# EAGLE design arduino_shield (EAGLE 8.3.2)
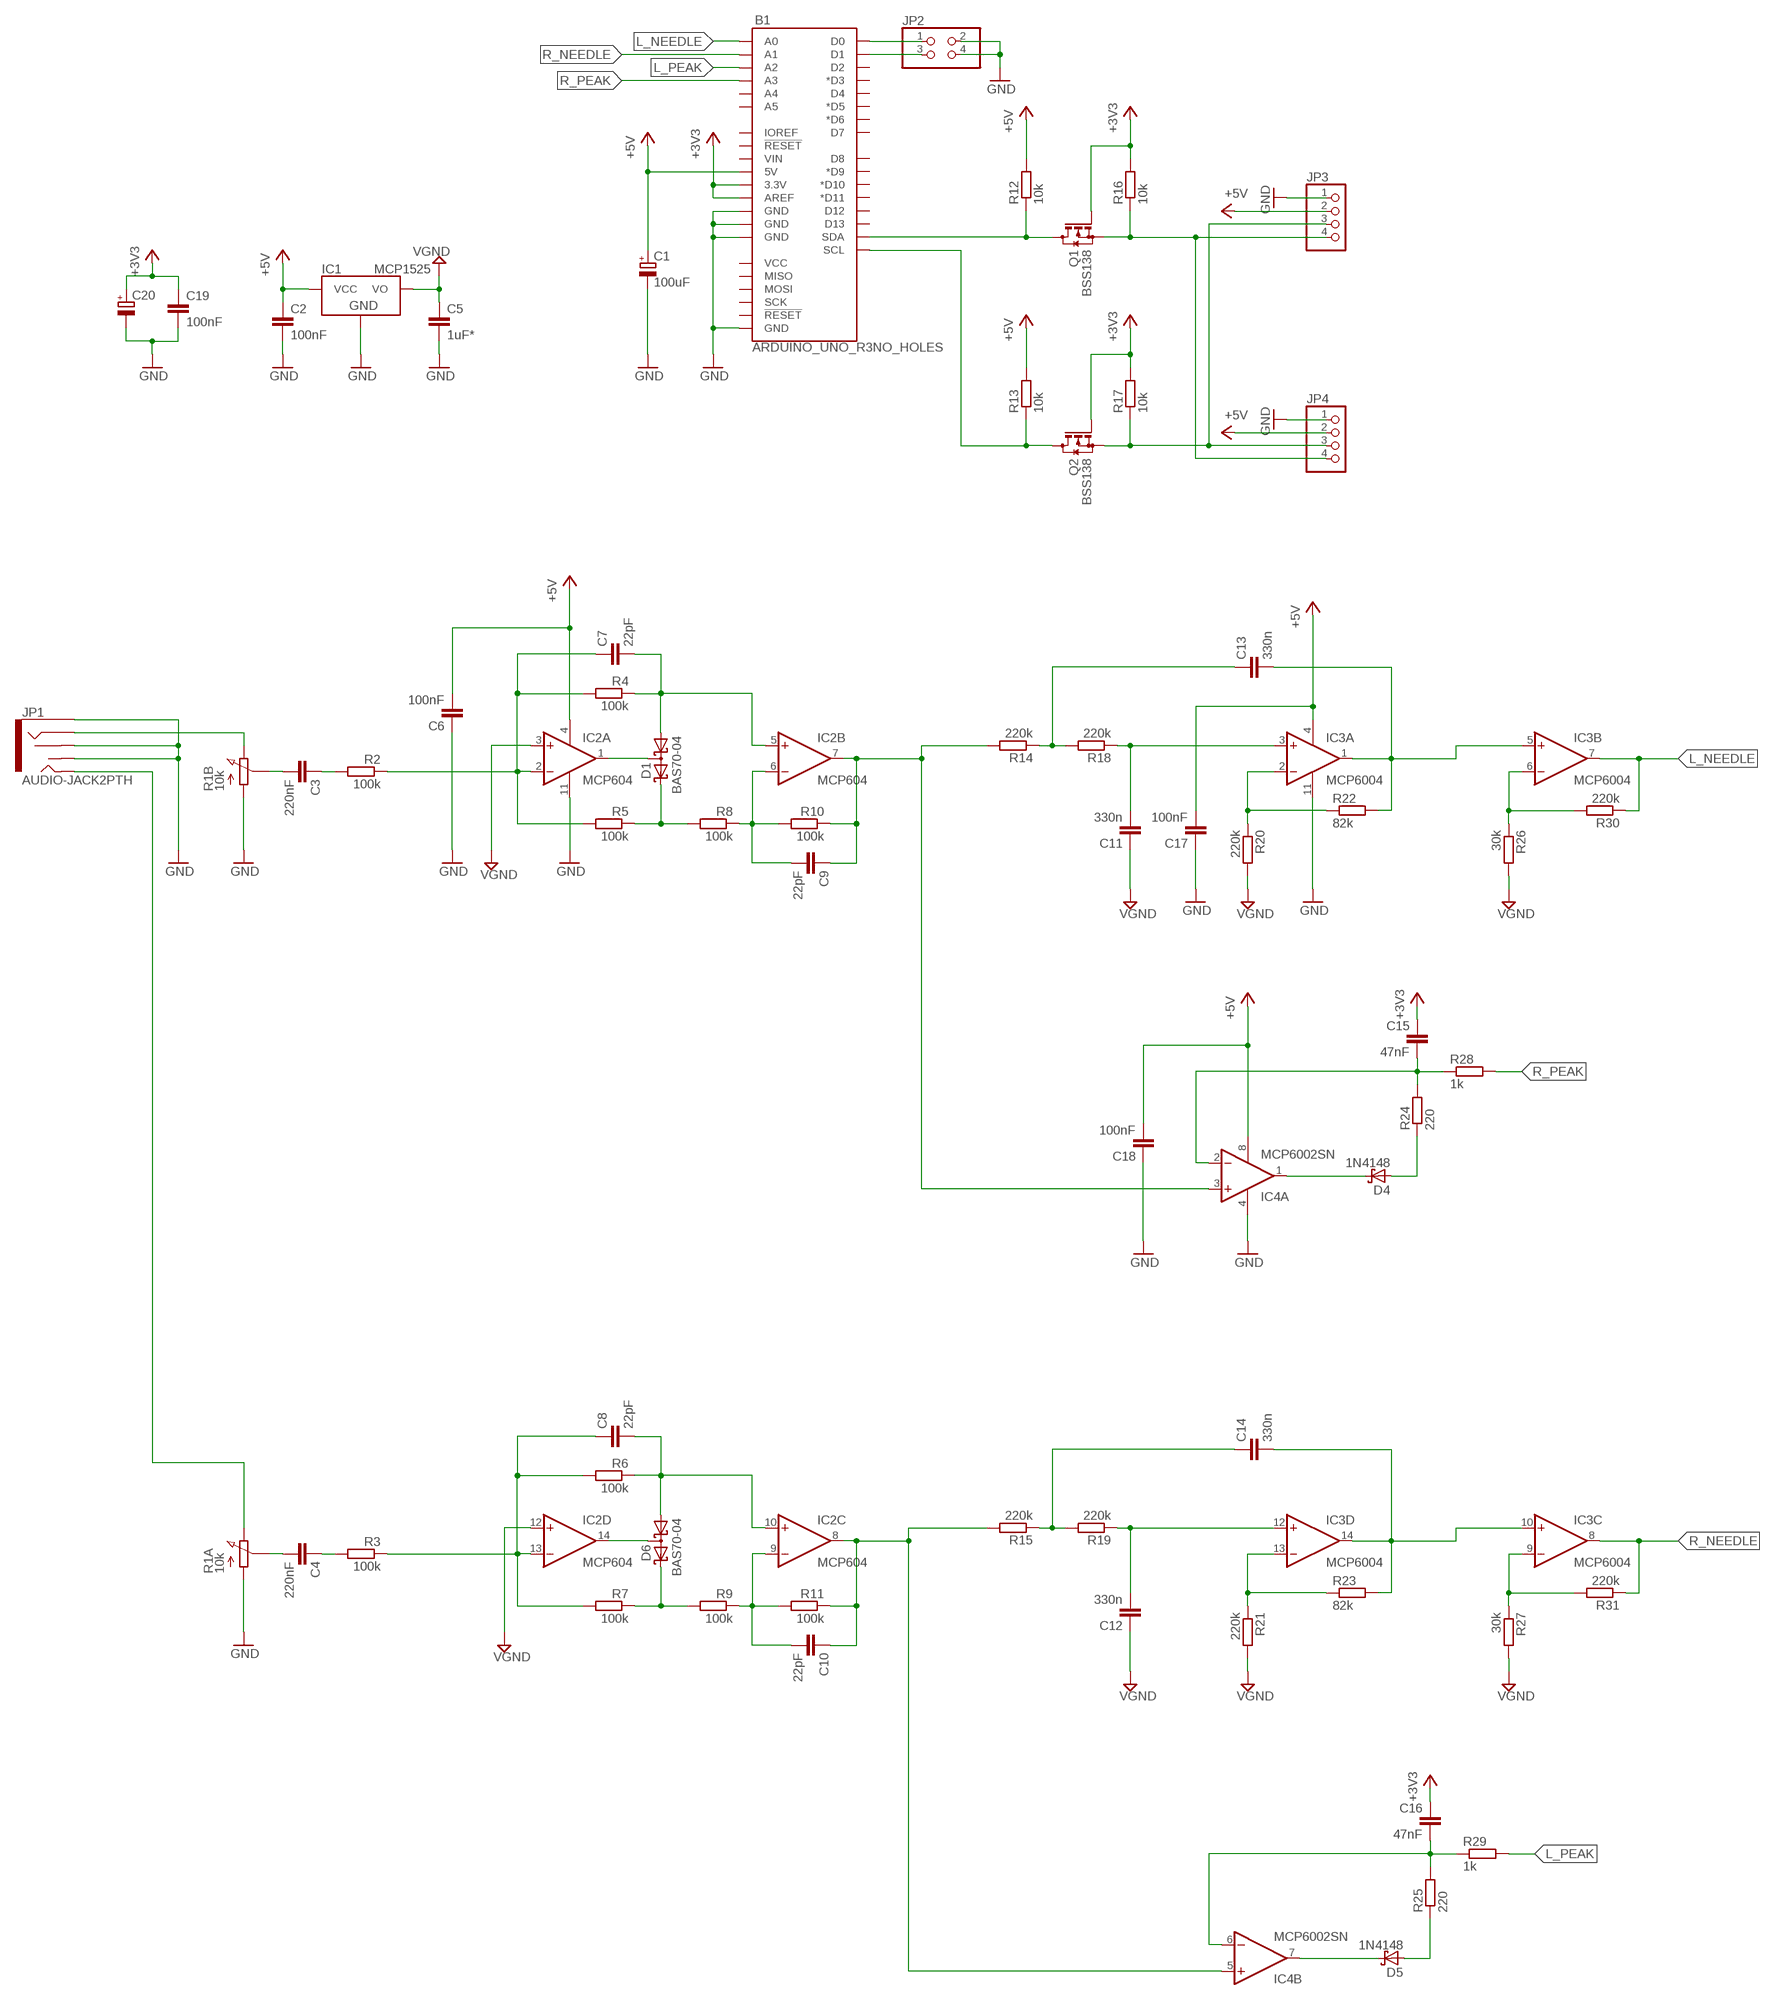
[diagram p0: schematic, sheet 1]

## Parts
B1  ARDUINO_UNO_R3NO_HOLES  [ARDUINO_R3_NO_HOLES]
C1  100uF  CPOL-EUB/3528-21R  [B/3528-21R]
C2  100nF  C-EUC0805  [C0805]
C3  220nF  C-EUC0805  [C0805]
C4  220nF  C-EUC0805  [C0805]
C5  1uF*  C-EUC0805  [C0805]
C6  100nF  C-EUC0805  [C0805]
C7  22pF  C-EUC0805  [C0805]
C8  22pF  C-EUC0805  [C0805]
C9  22pF  C-EUC0805  [C0805]
C10  22pF  C-EUC0805  [C0805]
C11  330n  C-EUC0805  [C0805]
C12  330n  C-EUC0805  [C0805]
C13  330n  C-EUC0805  [C0805]
C14  330n  C-EUC0805  [C0805]
C15  47nF  C-EUC0805  [C0805]
C16  47nF  C-EUC0805  [C0805]
C17  100nF  C-EUC0805  [C0805]
C18  100nF  C-EUC0805  [C0805]
C19  100nF  C-EUC0805  [C0805]
C20  CPOL-EUA/3216-18R  [A/3216-18R]
D1  BAS70-04  [SOT23]
D4  1N4148  BAT60J  [SOD323_ST]
D5  1N4148  BAT60J  [SOD323_ST]
D6  BAS70-04  [SOT23]
IC1  MCP1525  MCP9700SMD  [SOT23-3]
IC2  MCP604  MCP604SL  [SO14]
IC3  MCP6004  MCP604SL  [SO14]
IC4  MCP6002SN  MCP602SN  [SO08]
JP1  AUDIO-JACK2PTH  [AUDIO-JACK]
JP2  PINHD-2X2  [2X02]
JP3  PINHD-1X4  [1X04]
JP4  PINHD-1X4  [1X04]
Q1  BSS138  BSS123  [SOT23]
Q2  BSS138  BSS123  [SOT23]
R1  10k  POT1  [POT1]
R2  100k  R-EU_R0805  [R0805]
R3  100k  R-EU_R0805  [R0805]
R4  100k  R-EU_R0805  [R0805]
R5  100k  R-EU_R0805  [R0805]
R6  100k  R-EU_R0805  [R0805]
R7  100k  R-EU_R0805  [R0805]
R8  100k  R-EU_R0805  [R0805]
R9  100k  R-EU_R0805  [R0805]
R10  100k  R-EU_R0805  [R0805]
R11  100k  R-EU_R0805  [R0805]
R12  10k  R-EU_R0805  [R0805]
R13  10k  R-EU_R0805  [R0805]
R14  220k  R-EU_M0805  [M0805]
R15  220k  R-EU_M0805  [M0805]
R16  10k  R-EU_R0805  [R0805]
R17  10k  R-EU_R0805  [R0805]
R18  220k  R-EU_R0805  [R0805]
R19  220k  R-EU_R0805  [R0805]
R20  220k  R-EU_R0805  [R0805]
R21  220k  R-EU_R0805  [R0805]
R22  82k  R-EU_R0805  [R0805]
R23  82k  R-EU_R0805  [R0805]
R24  220  R-EU_R0805  [R0805]
R25  220  R-EU_R0805  [R0805]
R26  30k  R-EU_M0805  [M0805]
R27  30k  R-EU_M0805  [M0805]
R28  1k  R-EU_R0805  [R0805]
R29  1k  R-EU_R0805  [R0805]
R30  220k  R-EU_M0805  [M0805]
R31  220k  R-EU_M0805  [M0805]

## Nets
+3V3: B1.3.3V B1.AREF C15.1 C16.1 C19.1 C20.+ Q1.1(G) Q2.1(G) R16.2 R17.2
+5V: B1.5V C1.+ C2.1 C6.2 C17.2 C18.2 IC1.1(VCC) IC2.4(P:V+) IC3.4(P:V+) IC4.8(P:V+) JP3.2 JP4.2 R12.2 R13.2
GND: B1.GND@1(GND) B1.GND@2(GND) B1.GND@3(GND) B1.GND@4(GND) C1.- C2.2 C5.2 C6.1 C17.1 C18.1 C19.2 C20.- IC1.3(GND) IC2.11(P:V-) IC3.11(P:V-) IC4.4(P:V-) JP1.RSH JP1.SLEEVE JP1.TSH JP2.2 JP2.4 JP3.1 JP4.1 R1.1-1(A:A-1) R1.2-1(B:A-1)
GND1: C5.1 C11.1 C12.1 IC1.2(VO) IC2.3(A:+IN) IC2.12(D:+IN) R20.2 R21.2 R26.2 R27.2 ; supply symbol labelled VGND
L_NEEDLE: B1.A0 IC3.7(B:OUT) R30.1
L_PEAK: B1.A2 R29.2
N$1: IC3.6(B:-IN) R26.1 R30.2
N$2: B1.D0 JP2.1
N$3: B1.SDA Q1.3(D) R12.1
N$4: D5.A R25.1
N$6: B1.SCL Q2.3(D) R13.1
N$7: B1.D1 JP2.3
N$8: D5.C IC4.7(B:OUT)
N$9: C13.1 R14.1 R18.2
N$10: C13.2 IC3.1(A:OUT) IC3.5(B:+IN) R22.2
N$11: C16.2 IC4.6(B:-IN) R25.2 R29.1
N$13: IC3.9(C:-IN) R27.1 R31.2
N$14: C11.2 IC3.3(A:+IN) R18.1
N$15: IC3.2(A:-IN) R20.1 R22.1
N$16: D1.2(C2) R5.1 R8.2
N$17: C12.2 IC3.12(D:+IN) R19.1
N$18: C3.2 R1.2-2(B:S-2)
N$19: C7.1 IC2.2(A:-IN) R2.1 R4.2 R5.2
N$20: D4.C IC4.1(A:OUT)
N$23: IC3.13(D:-IN) R21.1 R23.1
N$24: C14.1 R15.1 R19.2
N$25: C7.2 D1.1(A1) IC2.5(B:+IN) R4.1
N$26: D1.3(C1A2) IC2.1(A:OUT)
N$27: C9.2 IC2.6(B:-IN) R8.1 R10.2
N$28: C14.2 IC3.10(C:+IN) IC3.14(D:OUT) R23.2
N$31: D6.2(C2) R7.1 R9.2
N$33: C8.1 IC2.13(D:-IN) R3.1 R6.2 R7.2
N$34: C8.2 D6.1(A1) IC2.10(C:+IN) R6.1
N$35: D6.3(C1A2) IC2.14(D:OUT)
N$36: C10.2 IC2.9(C:-IN) R9.1 R11.2
N$37: C10.1 IC2.8(C:OUT) IC4.5(B:+IN) R11.1 R15.2
N$38: C4.2 R1.1-2(A:S-2)
N$39: C4.1 R3.2
N$40: C3.1 R2.2
N$41: JP1.RING R1.2-3(B:E-3)
N$42: JP1.TIP R1.1-3(A:E-3)
N$44: C15.2 IC4.2(A:-IN) R24.2 R28.1
N$45: D4.A R24.1
N$48: C9.1 IC2.7(B:OUT) IC4.3(A:+IN) R10.1 R14.2
R_NEEDLE: B1.A1 IC3.8(C:OUT) R31.1
R_PEAK: B1.A3 R28.2
SCL: JP3.3 JP4.3 Q2.2(S) R17.1
SDA: JP3.4 JP4.4 Q1.2(S) R16.1
Unconnected: B1.A4 B1.A5 B1.D2 B1.D3(*D3) B1.D4 B1.D5(*D5) B1.D6(*D6) B1.D7 B1.D8 B1.D9(*D9) B1.D10(*D10) B1.D11(*D11) B1.D12 B1.D13 B1.IOREF B1.MISO B1.MOSI B1.RESET@1(!RESET!) B1.RESET@2(!RESET!) B1.SCK B1.VCC B1.VIN

## Library data of the parts
B1 = SparkFun-Boards:ARDUINO_UNO_R3: Arduino R3 Footprint with SPI header Arduino Uno R3 Compatible Footprint. Matches PCB size of the original board. SparkFun Products: SAMD21 Dev Breakout <https://www.sparkfun.com/products/13672> RedBoard <https://www.sparkfun.com/products/12757> R3 Stackable Headers <https://www.sparkfun.com/products/11417>
C1 C20 = rcl:CPOL-EU: POLARIZED CAPACITOR, European symbol
C2-C19 = rcl:C-EU: CAPACITOR, European symbol
D1 D6 = diode:BAS70-04: Silicon Schottky Diodes General-purpose diode for high-speed switching
D4 D5 = diode:BAT60J: Schottky barrier diode Source: www.st.com, BAT60J.pdf
IC1 = SparkFun:MCP9700
IC2 IC3 = linear:MCP604: Quad Op Amp 2.7V to 6.0V Single Supply CMOS Source: http://ww1.microchip.com/downloads/en/DeviceDoc/21314g.pdf
IC4 = linear:MCP602: Single Op Amp 2.7V to 6.0V Single Supply CMOS Source: http://ww1.microchip.com/downloads/en/DeviceDoc/21314g.pdf
JP1 = SparkFun:AUDIO-JACK2
JP2 = pinhead:PINHD-2X2: PIN HEADER
JP3 JP4 = pinhead:PINHD-1X4: PIN HEADER
Q1 Q2 = transistor-small-signal:BSS123: N-CHANNEL MOS FET
R1 = vu_meter:POT1
R2-R31 = rcl:R-EU_: RESISTOR, European symbol

## Module BALLISTICS
Ports: INPUT(io) OUTPUT(io)

### Library data of the parts

## Board
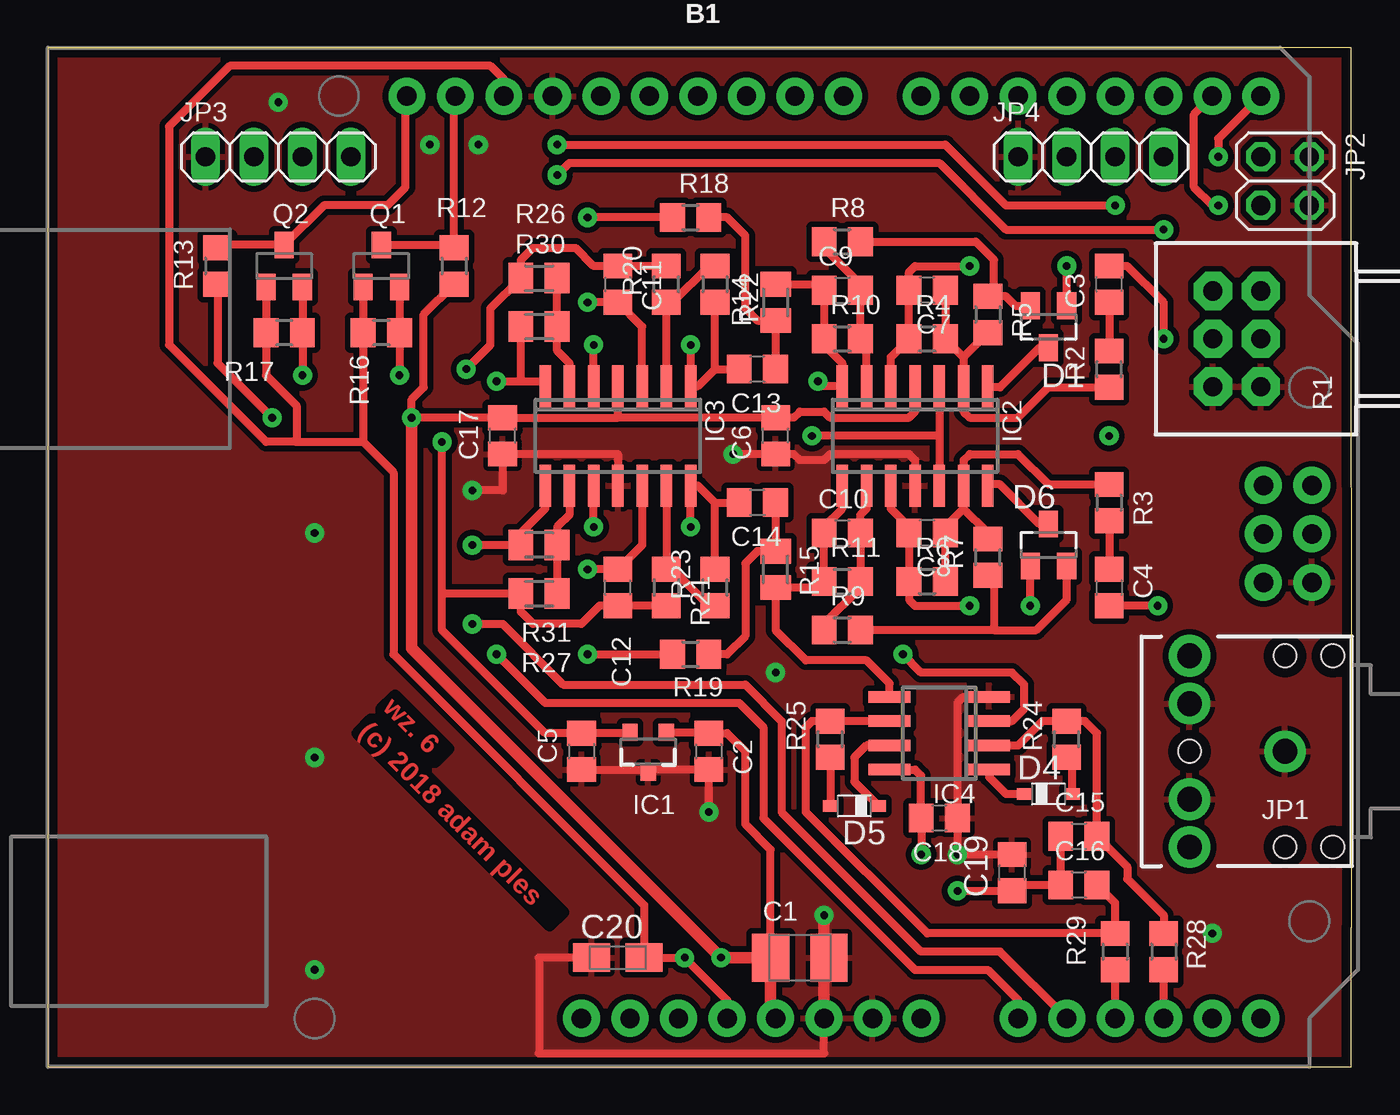
[diagram p1: board, top side]
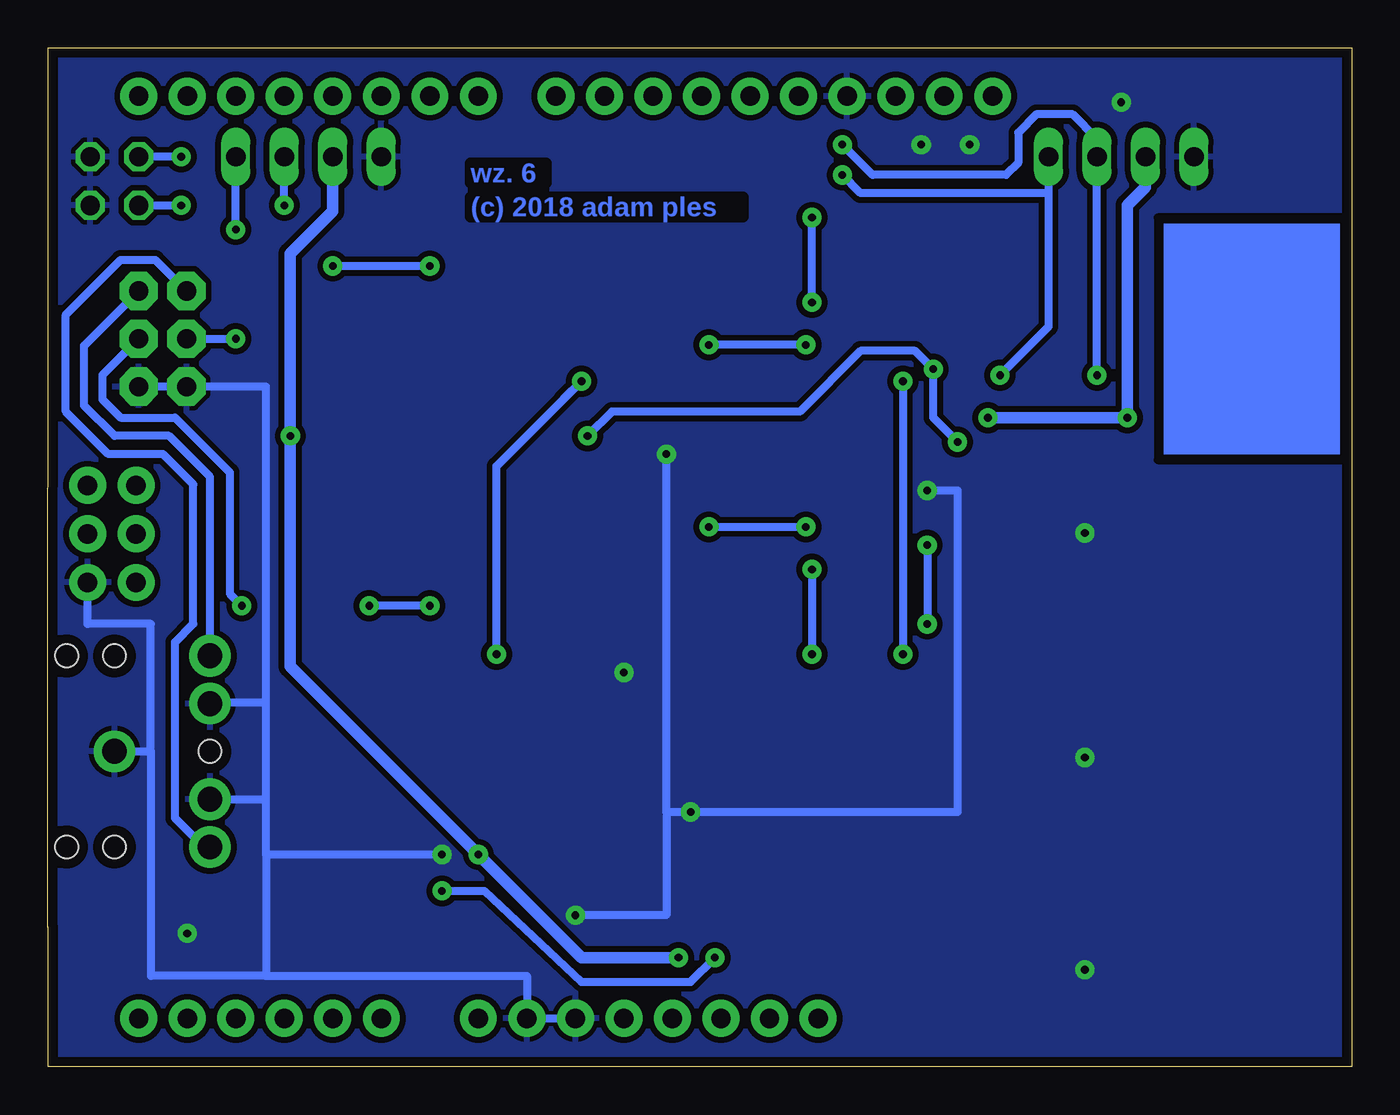
[diagram p2: board, bottom side, seen from below]

Size 68.26 x 53.33 mm. Coordinates in mm from the lower left corner, seen from the top.
Outline: 0,0 68.25,0 68.25,7.3 68.26,7.3 68.25,53.33 0,53.33 0,0
Copper layers (1*16): Top 0.035mm / dielectric 1.5mm / Bottom 0.035mm
Design rules "default *": minimum track width 6mil, minimum drill 0.35mm, track to track 12mil, track to pad 12mil, pad to pad 12mil, via to via 12mil, smd to smd 10mil, copper to edge 20mil, drill to drill 6mil, minimum pad ring 10mil, minimum via ring 8mil, stop-mask expansion 4mil, vias tented up to drill 0mil, thermal gap 10mil
bRestrict: 4 lines

### Footprints (pad centres in the part's own frame; a part is rotated, then mirrored left to right if it is on the bottom)
ARDUINO_R3_NO_HOLES = drill 1.016 pad 1.93: 3.3V 1.27,-24.13; 5V 3.81,-24.13; A0 16.51,-24.13; A1 19.05,-24.13; A2 21.59,-24.13; A3 24.13,-24.13; A4 26.67,-24.13; A5 29.21,-24.13; AREF -10.414,24.13; D0 29.21,24.13; D1 26.67,24.13; D2 24.13,24.13; D3 21.59,24.13; D4 19.05,24.13; D5 16.51,24.13; D6 13.97,24.13; D7 11.43,24.13; D8 7.366,24.13; D9 4.826,24.13; D10 2.286,24.13; D11 -0.254,24.13; D12 -2.794,24.13; D13 -5.334,24.13; GND@1 6.35,-24.13; GND@2 8.89,-24.13; GND@3 -7.874,24.13; GND@4 31.89,-1.32; IOREF -3.81,-24.13; MISO 29.35,3.76; MOSI 31.89,1.22; NC -6.35,-24.13; RESET@1 -1.27,-24.13; RESET@2 29.35,-1.32; SCK 29.35,1.22; SCL -15.494,24.13; SDA -12.954,24.13; VCC 31.89,3.76; VIN 11.43,-24.13
B/3528-21R = smd 1.95 x 2.5: + 1.525,0; - -1.525,0
C0805 = smd 1.3 x 1.5: 1 -0.95,0; 2 0.95,0
A/3216-18R = smd 1.95 x 1.5: + 1.375,0; - -1.375,0
SOT23 = smd 1 x 1.4: 1 -0.95,-1.1; 2 0.95,-1.1; 3 0,1.1
SOD323_ST = smd 0.8 x 0.6: A 1.25,0; C -1.25,0
SOT23-3 = smd 0.8 x 0.9: 1 -0.95,-1; 2 0.95,-1; 3 0,1.1
SO14 = smd 0.6 x 2.2: 1 -3.81,-2.6; 2 -2.54,-2.6; 3 -1.27,-2.6; 4 0,-2.6; 5 1.27,-2.6; 6 2.54,-2.6; 7 3.81,-2.6; 8 3.81,2.6; 9 2.54,2.6; 10 1.27,2.6; 11 0,2.6; 12 -1.27,2.6; 13 -2.54,2.6; 14 -3.81,2.6
SO08 = smd 0.6 x 2.2: 1 -1.905,-2.6; 2 -0.635,-2.6; 3 0.635,-2.6; 4 1.905,-2.6; 5 1.905,2.6; 6 0.635,2.6; 7 -0.635,2.6; 8 -1.905,2.6
AUDIO-JACK = drill 1.3 pad 2.184: RING 5,5; RSH 5,2.5; SLEEVE 0,0; TIP 5,-5; TSH 5,-2.5 | hole 1.2: 0,5; -2.5,5; -2.5,-5; 0,-5; 5,0
2X02 = drill 1.016 octagon: 1 -1.27,-1.27; 2 -1.27,1.27; 3 1.27,-1.27; 4 1.27,1.27
1X04 = drill 1.016 long: 1 -3.81,0; 2 -1.27,0; 3 1.27,0; 4 3.81,0
POT1 = drill 1 pad 2 octagon: 1-1 -2.5,0; 1-2 0,0; 1-3 2.5,0; 2-1 -2.5,2.5; 2-2 0,2.5; 2-3 2.5,2.5
R0805 = smd 1.3 x 1.5: 1 -0.95,0; 2 0.95,0
M0805 = smd 1.3 x 1.6: 1 -0.95,0; 2 0.95,0

### Placement (x,y rotation side)
B1  34.29,26.67 0 top
C1  39.37,5.71 180 top
C2  34.61,16.51 270 top
C3  55.56,40.96 90 top
C4  55.56,25.08 270 top
C5  27.94,16.51 270 top
C6  38.1,33.02 90 top
C7  46.04,40.64 180 top
C8  46.04,27.94 180 top
C9  41.59,40.64 0 top
C10  41.59,27.94 0 top
C11  29.84,40.96 270 top
C12  29.84,25.08 90 top
C13  37.15,36.51 180 top
C14  37.15,29.53 180 top
C15  53.98,12.06 0 top
C16  53.98,9.53 0 top
C17  23.81,33.02 90 top
C18  46.67,13.02 180 top
C19  50.48,10.16 90 top
C20  29.84,5.71 0 top
D1  52.39,38.73 180 top
D4  52.39,14.29 0 top
D5  42.23,13.65 180 top
D6  52.39,27.3 0 top
IC1  31.43,16.51 180 top
IC2  45.4,33.02 180 top
IC3  29.84,33.02 180 top
IC4  46.67,17.46 90 top
JP1  64.77,16.51 180 top
JP2  64.77,46.35 270 top
JP3  12.06,47.62 0 top
JP4  54.61,47.62 0 top
Q1  17.46,41.91 0 top
Q2  12.38,41.91 0 top
R1  63.5,38.1 90 top
R2  55.56,36.51 90 top
R3  55.56,29.53 270 top
R4  46.04,38.1 0 top
R5  49.21,39.37 270 top
R6  46.04,25.4 0 top
R7  49.21,26.67 90 top
R8  41.59,43.18 0 top
R9  41.59,22.86 0 top
R10  41.59,38.1 0 top
R11  41.59,25.4 0 top
R12  21.27,41.91 270 top
R13  8.89,41.91 270 top
R14  38.1,40.01 90 top
R15  38.1,26.04 270 top
R16  17.46,38.42 180 top
R17  12.38,38.42 180 top
R18  33.66,44.45 0 top
R19  33.66,21.59 0 top
R20  32.38,40.96 90 top
R21  32.38,25.08 270 top
R22  34.92,40.96 270 top
R23  34.92,25.08 90 top
R24  53.34,17.14 90 top
R25  40.96,17.14 90 top
R26  25.72,41.27 180 top
R27  25.72,24.77 180 top
R28  58.42,6.03 270 top
R29  55.88,6.03 270 top
R30  25.72,38.73 0 top
R31  25.72,27.3 0 top

### Tracks (layer width: path | path; a pad name or v marks a point on that pad's centre or on a via)
+3V3  (via drill 0.4 pad 1)
  Top 0.406: Q2.1 R17.2 11.43,36.19 13.02,34.61 13.02,32.7 | Q1.1 R16.2 16.51,32.7 | B1.AREF 23.88,51.69 23.18,52.39 9.53,52.39 6.35,49.21 6.35,37.78 11.43,32.7 13.02,32.7 | 13.02,32.7 16.51,32.7 | 16.51,32.7 18.1,31.11 18.1,21.59 31.22,8.47 C20.+ v33.34,5.71 35.56,3.49 B1.3.3V | C15.1 C16.1 50.8,9.53 C19.1 48.26,9.21 v47.62,9.21
  Bottom 0.406: v47.62,9.21 45.4,9.21 40.32,4.45 34.61,4.45 v33.34,5.71
+5V  (via drill 0.4 pad 1)
  Top 0.406: IC2.4 45.4,34.29 45.08,33.97 40.96,33.97 40.64,34.29 39.37,34.29 39.05,33.97 C6.2 29.85,33.97 | 29.85,33.97 C17.2 v19.05,33.97 19.05,34.92 19.68,35.56 19.68,39.37 R12.2 | 29.85,33.97 29.84,34.29 IC3.4 | IC1.1 34.56,17.51 C2.1 35.56,17.46 36.51,16.51 36.51,12.7 37.84,11.37 C1.+ 38.1,5.65 | R13.2 8.89,36.83 v11.75,33.97 | IC4.8 45.4,15.56 45.72,15.24 C18.2 | C18.2 v45.72,11.11 | C18.2
  Top 0.61: v19.05,33.97 19.05,21.91 v35.24,5.71 C1.+ 37.84,2.79 B1.5V
  Bottom 0.61: JP3.2 10.79,46.04 11.75,45.09 v11.75,33.97 v19.05,33.97 | JP4.2 53.34,44.77 55.56,42.55 v55.56,33.02 55.56,20.95 v45.72,11.11 40.32,5.71 v35.24,5.71
GND  (via drill 0.4 pad 1)
  Top 0.406: IC2.11 45.4,31.75 45.08,32.07 40.96,32.07 40.64,31.75 39.37,31.75 39.05,32.07 C6.1 v35.88,32.07 | IC3.11 29.84,31.75 29.85,32.07 C17.1 23.81,30.16 v22.23,30.16 | C5.2 31.28,15.56 IC1.3 31.58,15.56 C2.2 v34.61,13.34 | IC4.4 47.94,19.37 47.62,19.05 C18.1 v47.62,11.12 v47.62,11.11 C19.2 | C20.- 25.72,5.71 25.72,0.71 40.64,0.71 B1.GND@1
  Top 0.61: B1.GND@1 40.64,5.71 | v40.64,7.94 40.64,5.71 | 40.64,5.71 C1.-
  Bottom 0.406: v40.64,7.94 35.88,7.94 35.88,13.34 | v22.23,30.16 20.64,30.16 20.64,13.34 v34.61,13.34 35.88,13.34 | 63.54,35.56 R1.1-1 R1.2-1 56.83,35.6 56.83,19.05 | 56.83,11.11 56.83,14.01 | 56.83,11.11 56.83,4.76 | 56.83,14.01 56.83,19.05 | 56.83,19.05 59.77,19.05 JP1.TSH | JP1.RSH 56.83,14.01 | 35.88,13.34 v35.88,32.07 | B1.GND@1 B1.GND@2 43.18,4.76 56.83,4.76 | 56.83,4.76 62.87,4.76 62.87,16.51 | 62.87,16.51 62.87,23.18 66.18,23.18 B1.GND@4 | JP1.SLEEVE 62.87,16.51 | v47.62,11.11 56.83,11.11
  other vias: 20,48.26 22.54,48.26 38.1,20.64 12.06,50.48 13.97,5.08 13.97,16.19 13.97,27.94 60.96,6.99
  pour Bottom: 0,53.34 68.26,53.34 68.26,0 0,0
  pour Top: 0,53.34 0,0 68.26,0 68.26,53.34
GND1  (via drill 0.4 pad 1)
  Top 0.406: IC2.3 46.67,33.02 | 46.67,33.02 IC2.12 | IC1.2 30.43,17.46 C5.1 26.04,17.46 20.64,22.86 20.64,24.77 | 46.67,33.02 v40.01,33.02 | R20.2 C11.1 | C11.1 | R21.2 C12.1 | C12.1 | C12.1 28.89,24.13 27.94,23.18 25.4,23.18 24.77,23.81 R27.2 20.64,24.77 | R26.2 | 20.64,24.77 v20.64,32.7 | v21.91,36.51 23.18,37.78 23.18,39.69 R26.2 | C11.1 28.58,41.91 27.62,42.86 25.4,42.86 24.77,42.23 R26.2
  Bottom 0.406: v20.64,32.7 21.91,33.97 v21.91,36.51 22.86,37.47 25.72,37.47 28.89,34.29 38.73,34.29 v40.01,33.02
L_NEEDLE  (via drill 0.4 pad 1)
  Top 0.406: v23.5,21.59 26.04,19.05 36.2,19.05 37.47,17.78 37.47,13.02 45.4,5.08 49.21,5.08 50.8,3.49 B1.A0 | R30.1 24.77,35.88 | 24.77,35.88 26.04,35.88 IC3.7 | v23.5,35.88 24.77,35.88
  Bottom 0.406: v23.5,35.88 v23.5,21.59
L_PEAK
  Top 0.406: B1.A2 R29.2
N$1
  Top 0.406: IC3.6 27.3,36.83 26.67,37.47 R30.2 R26.1
N$2  (via drill 0.4 pad 1)
  Top 0.406: B1.D0 61.28,48.58 v61.28,47.62
  Bottom 0.406: v61.28,47.62 JP2.1
N$3
  Top 0.406: Q1.3 20.49,43.01 R12.1 21.27,50.74 B1.SDA
N$4
  Top 0.406: R25.1 40.98,16.18 D5.A
N$6
  Top 0.406: R13.1 9.04,43.01 Q2.3 14.46,45.09 17.78,45.09 18.73,46.04 18.73,50.74 B1.SCL
N$7  (via drill 0.4 pad 1)
  Top 0.406: v61.28,45.09 60.96,45.09 60.01,46.04 60.01,49.85 B1.D1
  Bottom 0.406: JP2.3 v61.28,45.09
N$8
  Top 0.406: IC4.7 42.86,16.83 42.23,16.19 42.23,14.92 43.48,13.67 D5.C
N$9
  Top 0.406: R18.2 35.56,44.45 36.51,43.5 36.51,39.69 37.15,39.05 R14.1 C13.1
N$10  (via drill 0.4 pad 1)
  Top 0.406: 34.92,36.51 34.03,35.62 IC3.1 v33.66,37.78 | 34.92,36.51 C13.2 | 34.92,36.51 R22.2 | IC3.5 v28.57,37.78
  Bottom 0.406: v28.57,37.78 v33.66,37.78
N$11
  Top 0.406: C16.2 55.88,8.57 R29.1 | R29.1 | R29.1 46.04,6.99 39.69,13.34 39.69,17.78 40.01,18.1 R25.2 IC4.6
N$13
  Top 0.406: IC3.9 27.3,28.89 26.67,28.26 R31.2 R27.1
N$14  (via drill 0.4 pad 1)
  Top 0.406: IC3.3 31.11,38.74 C11.2 v28.25,40.01 v28.26,40.01 | R18.1 v28.26,44.45
  Bottom 0.406: v28.26,40.01 v28.26,44.45
N$15
  Top 0.406: IC3.2 R20.1 32.7,40.01 34.6,41.91 R22.1
N$16
  Top 0.406: R8.2 48.58,43.18 49.53,42.23 49.53,40.32 | 49.53,40.32 R5.1 | 49.53,40.32 50.16,40.32 50.65,39.84 D1.2
N$17  (via drill 0.4 pad 1)
  Top 0.406: IC3.12 31.11,27.3 C12.2 v28.26,26.03 v28.26,26.04 | v28.26,21.59 R19.1
  Bottom 0.406: v28.26,26.04 v28.26,21.59
N$18  (via drill 0.4 pad 1)
  Top 0.406: v58.42,38.1 58.42,40.01 56.52,41.91 C3.2
  Bottom 0.406: R1.2-2 v58.42,38.1
N$19
  Top 0.406: 47.94,37.15 IC2.2 47.94,34.29 48.26,33.97 50.8,33.97 52.39,35.56 R2.1 | 47.94,37.15 R4.2 C7.1 | R5.2 47.94,37.15
N$20
  Top 0.406: IC4.1 49.27,15.18 50.16,14.29 D4.C
N$23
  Top 0.406: IC3.13 R21.1 32.7,26.03 34.6,24.13 R23.1
N$24
  Top 0.406: C14.1 R15.1 37.15,26.98 36.51,26.35 36.51,22.54 35.56,21.59 R19.2
N$25  (via drill 0.4 pad 1)
  Top 0.406: IC2.5 44.13,37.15 R4.1 C7.2 45.09,41.59 45.4,41.91 v48.26,41.91 | 53.34,40.64 v53.34,41.91 | 53.34,40.64 D1.1 | D1.1 | D1.1 53.34,40.64
  Bottom 0.406: v48.26,41.91 v53.34,41.91
N$26
  Top 0.406: IC2.1 49.27,35.56 49.85,35.56 51.92,37.63 D1.3
N$27
  Top 0.406: IC2.6 42.86,37.78 R10.2 C9.2 42.23,40.95 42.23,41.27 40.96,42.55 40.96,42.87 R8.1
N$28  (via drill 0.4 pad 1)
  Top 0.406: v28.57,28.26 IC3.10 | v33.66,28.26 IC3.14 34.03,30.42 34.92,29.53 | R23.2 34.92,29.53 | 34.92,29.53 C14.2
  Bottom 0.406: v33.66,28.26 v28.57,28.26
N$31
  Top 0.406: 49.53,22.86 51.75,22.86 53.34,24.45 D6.2 | 49.53,22.86 R9.2 | R7.1 49.53,25.4 49.53,22.86
N$33
  Top 0.406: 47.94,29.21 IC2.13 47.94,31.75 48.26,32.07 50.8,32.07 52.39,30.48 R3.1 | R6.2 C8.1 46.99,28.25 47.94,29.21 | R7.2 49.21,27.94 47.94,29.21
N$34  (via drill 0.4 pad 1)
  Top 0.406: IC2.10 44.13,29.21 45.09,28.25 C8.2 R6.1 45.09,24.45 45.4,24.13 v48.26,24.13 | v51.44,24.13 | v51.44,24.13 D6.1
  Bottom 0.406: v48.26,24.13 v51.44,24.13
N$35
  Top 0.406: IC2.14 49.27,30.48 49.85,30.48 51.92,28.41 D6.3
N$36
  Top 0.406: IC2.9 42.86,29.21 42.54,28.89 C10.2 R11.2 42.54,25.08 40.64,23.18 R9.1
N$37
  Top 0.406: IC2.8 41.59,29.21 40.64,28.26 C10.1 R11.1 40.33,25.09 R15.2 38.1,22.86 39.69,21.27 42.86,21.27 44.07,20.06 IC4.5
N$38  (via drill 0.4 pad 1)
  Top 0.406: C4.2 v58.1,24.13
  Bottom 0.406: R1.1-2 65.41,36.2 65.41,34.92 64.45,33.97 61.59,33.97 58.74,31.11 58.74,24.77 v58.1,24.13
N$39
  Top 0.406: R3.2 C4.1
N$40
  Top 0.406: C3.1 R2.2
N$41
  Bottom 0.406: JP1.RING 60.09,11.51 61.59,13.02 61.59,22.23 60.64,23.18 60.64,30.48 62.23,32.07 65.09,32.07 67.31,34.29 67.31,39.37 64.45,42.23 62.63,42.23 R1.2-3
N$42
  Bottom 0.406: JP1.TIP 59.77,30.88 61.91,33.02 64.77,33.02 66.36,34.61 66.36,37.74 R1.1-3
N$44
  Top 0.406: IC4.2 50.8,16.83 51.44,17.46 52.07,18.1 R24.2 54.3,18.1 54.29,18.1 54.93,17.46 C15.2 56.52,10.47 56.52,9.84 58.42,7.94 R28.1
N$45
  Top 0.406: D4.A 53.64,15.9 R24.1
N$48  (via drill 0.4 pad 1)
  Top 0.406: R14.2 40.33,40.95 C9.1 R10.1 40.64,37.78 41.59,36.83 IC2.7 40.58,35.62 v40.32,35.88 | IC4.3 50.48,18.1 51.12,18.73 51.12,20 50.48,20.64 45.72,20.64 v44.77,21.59
  Bottom 0.406: 41.27,34.92 v40.32,35.88 44.77,31.43 v44.77,21.59
R_NEEDLE  (via drill 0.4 pad 1)
  Top 0.406: B1.A1 49.85,6.03 45.72,6.03 38.42,13.34 38.42,18.1 36.51,20 26.99,20 23.81,23.18 v22.23,23.18 | IC3.8 26.04,29.21 24.77,27.94 R31.1 v22.23,27.3
  Bottom 0.406: v22.23,27.3 v22.23,23.18
R_PEAK
  Top 0.406: B1.A3 R28.2
SCL  (via drill 0.4 pad 1)
  Top 0.406: Q2.2 R17.1 v13.33,36.2 v13.34,36.2 | v26.67,48.26 46.99,48.26 50.16,45.09 v55.88,45.09
  Bottom 0.406: 55.88,46.99 JP4.3 v55.88,45.09 | v13.34,36.2 JP3.3 13.34,48.58 14.61,49.85 16.51,49.85 17.46,48.9 17.46,47.31 18.1,46.67 25.08,46.67 v26.67,48.26
SDA  (via drill 0.4 pad 1)
  Top 0.406: Q1.2 R16.1 v18.41,36.2 | v26.67,46.67 27.3,47.31 46.67,47.31 50.16,43.81 v58.42,43.81
  Bottom 0.406: 58.42,46.99 JP4.4 v58.42,43.81 | JP3.4 15.88,45.72 | 15.88,45.72 15.88,38.73 v18.41,36.2 | 15.88,45.72 25.72,45.72 v26.67,46.67
(copper drawn outside any net)
  shapes: Bottom area x1

### Text on the board
Top: wz. 6 | (c) 2018 adam ples
Bottom: wz. 6 | (c) 2018 adam ples